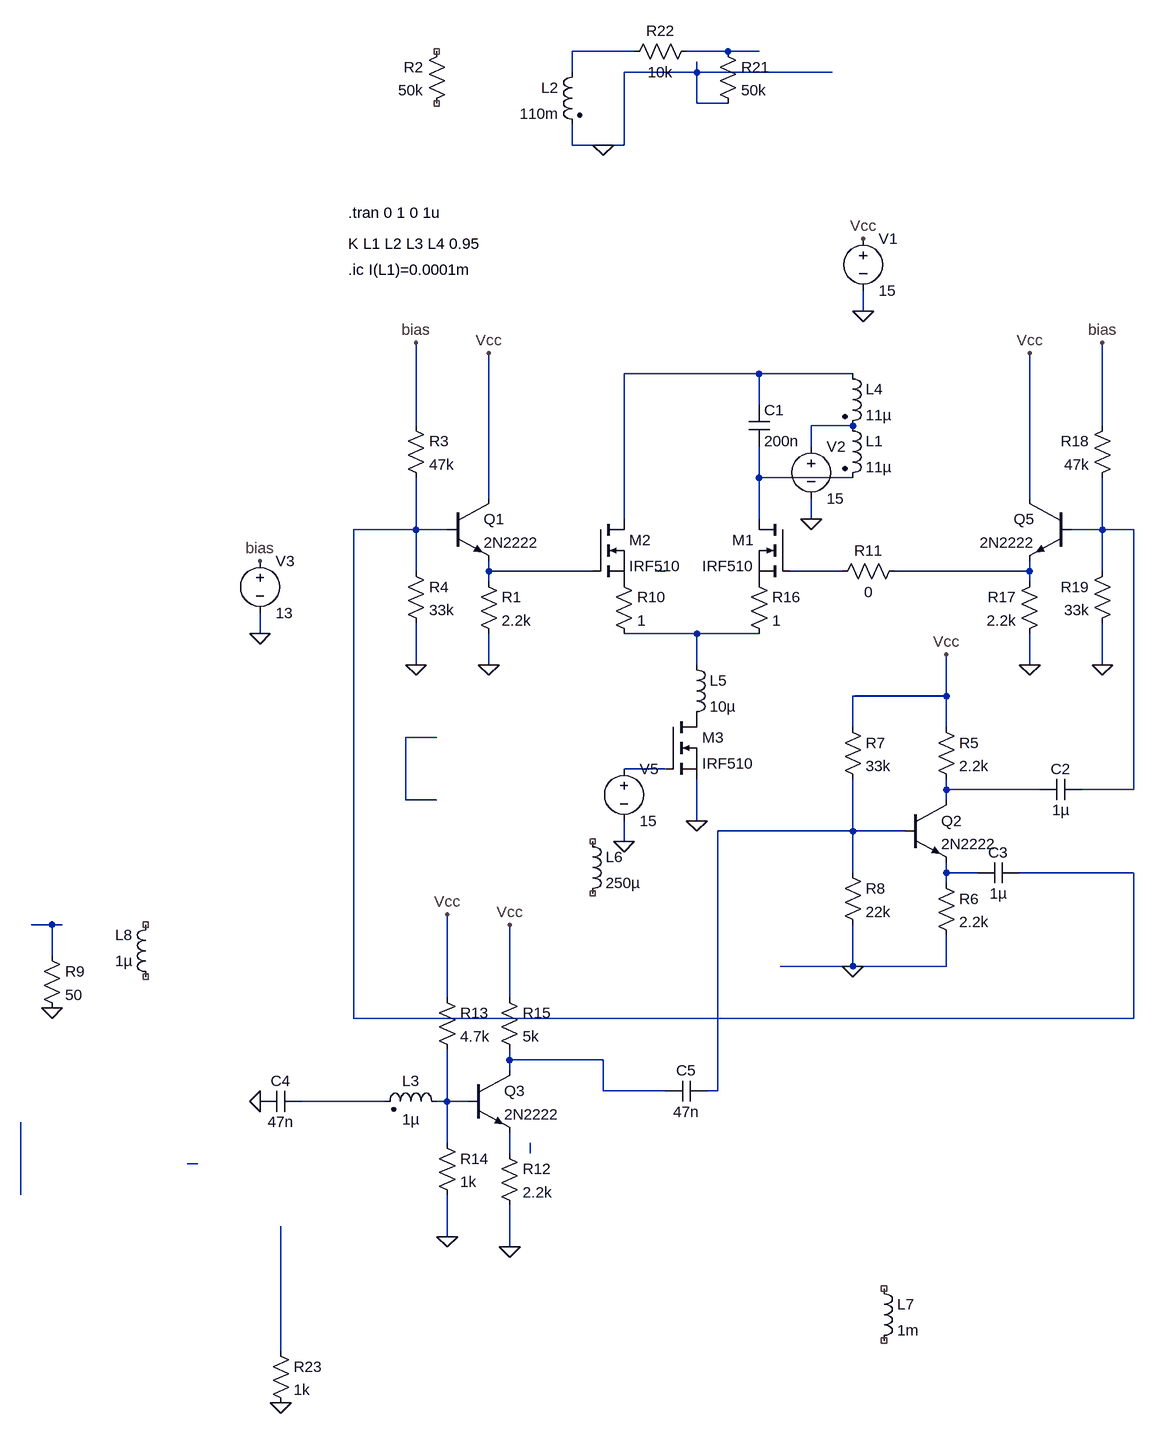
[diagram p0: schematic royer10_mosfet.asc]
royer10_mosfet.asc, the LTspice schematic file:
Version 4
SHEET 1 2216 1876
WIRE 48 -240 -48 -240
WIRE 192 -240 128 -240
WIRE 240 -240 192 -240
WIRE -48 -208 -48 -240
WIRE 144 -208 144 -224
WIRE 144 -208 32 -208
WIRE 352 -208 144 -208
WIRE 144 -160 144 -208
WIRE 192 -160 144 -160
WIRE -48 -96 -48 -128
WIRE 0 -96 -48 -96
WIRE 32 -96 32 -208
WIRE 32 -96 0 -96
WIRE 400 160 400 128
WIRE 240 256 32 256
WIRE 384 256 240 256
WIRE 240 304 240 256
WIRE -288 336 -288 208
WIRE 384 336 320 336
WIRE 768 336 768 208
WIRE 320 368 320 336
WIRE 240 416 240 368
WIRE 384 416 240 416
WIRE -176 448 -176 224
WIRE 656 448 656 224
WIRE 32 480 32 256
WIRE 240 480 240 416
WIRE 320 480 320 448
WIRE -288 496 -288 416
WIRE -288 496 -384 496
WIRE -240 496 -288 496
WIRE 768 496 768 416
WIRE 768 496 720 496
WIRE 816 496 768 496
WIRE -288 560 -288 496
WIRE -176 560 -176 544
WIRE -16 560 -176 560
WIRE 96 560 80 560
WIRE 368 560 288 560
WIRE 656 560 656 544
WIRE 656 560 448 560
WIRE 768 560 768 496
WIRE -176 576 -176 560
WIRE 656 576 656 560
WIRE -528 656 -528 624
WIRE 144 656 32 656
WIRE 240 656 144 656
WIRE -288 704 -288 640
WIRE -176 704 -176 656
WIRE 144 704 144 656
WIRE 656 704 656 656
WIRE 768 704 768 640
WIRE 528 752 528 688
WIRE 528 752 384 752
WIRE 384 800 384 752
WIRE 528 800 528 752
WIRE -256 816 -304 816
WIRE 96 864 32 864
WIRE 528 896 528 880
WIRE 672 896 528 896
WIRE 816 896 816 496
WIRE 816 896 736 896
WIRE -304 912 -304 816
WIRE -256 912 -304 912
WIRE 528 912 528 896
WIRE 144 944 144 880
WIRE 384 960 384 880
WIRE 384 960 176 960
WIRE 464 960 384 960
WIRE 32 976 32 944
WIRE 384 1024 384 960
WIRE 528 1024 528 1008
WIRE 576 1024 528 1024
WIRE 816 1024 640 1024
WIRE 528 1040 528 1024
WIRE -848 1104 -880 1104
WIRE -832 1104 -848 1104
WIRE -848 1152 -848 1104
WIRE 384 1168 384 1104
WIRE 384 1168 272 1168
WIRE 528 1168 528 1120
WIRE 528 1168 384 1168
WIRE -240 1216 -240 1088
WIRE -144 1216 -144 1104
WIRE -384 1248 -384 496
WIRE 816 1248 816 1024
WIRE 816 1248 -384 1248
WIRE -144 1312 -144 1296
WIRE 0 1312 -144 1312
WIRE -144 1328 -144 1312
WIRE 0 1360 0 1312
WIRE 96 1360 0 1360
WIRE 176 1360 176 960
WIRE 176 1360 160 1360
WIRE -336 1376 -464 1376
WIRE -240 1376 -240 1296
WIRE -240 1376 -256 1376
WIRE -208 1376 -240 1376
WIRE -240 1440 -240 1376
WIRE -144 1456 -144 1424
WIRE -112 1456 -112 1440
WIRE -624 1472 -640 1472
WIRE -896 1520 -896 1408
WIRE -240 1584 -240 1520
WIRE -144 1600 -144 1536
WIRE -496 1760 -496 1568
FLAG 400 160 0
FLAG 400 48 Vcc
FLAG 384 1168 0
FLAG 528 688 Vcc
FLAG 656 224 Vcc
FLAG 656 704 0
FLAG 768 704 0
FLAG -176 224 Vcc
FLAG -176 704 0
FLAG -288 704 0
FLAG 144 944 0
FLAG 320 480 0
FLAG -144 1104 Vcc
FLAG -144 1600 0
FLAG -240 1584 0
FLAG -240 1088 Vcc
FLAG -496 1840 0
FLAG -528 656 0
FLAG -528 544 bias
FLAG -288 208 bias
FLAG 768 208 bias
FLAG 0 -96 0
FLAG 32 976 0
FLAG -848 1232 0
FLAG -528 1376 0
SYMBOL voltage 400 32 R0
WINDOW 123 0 0 Left 0
WINDOW 39 0 0 Left 0
SYMATTR InstName V1
SYMATTR Value 15
SYMBOL ind2 368 320 R0
SYMATTR InstName L1
SYMATTR Value 11µ
SYMATTR Type ind
SYMBOL ind2 -32 -224 M0
SYMATTR InstName L2
SYMATTR Value 110m
SYMATTR Type ind
SYMATTR SpiceLine Rser=5
SYMBOL ind2 -240 1392 M270
WINDOW 0 32 56 VTop 2
WINDOW 3 4 56 VBottom 2
SYMATTR InstName L3
SYMATTR Value 1µ
SYMATTR Type ind
SYMATTR SpiceLine Rser=0.1
SYMBOL ind2 368 240 R0
SYMATTR InstName L4
SYMATTR Value 11µ
SYMATTR Type ind
SYMBOL cap 224 304 R0
SYMATTR InstName C1
SYMATTR Value 200n
SYMBOL res -240 -256 M0
SYMATTR InstName R2
SYMATTR Value 50k
SYMBOL npn 464 912 R0
SYMATTR InstName Q2
SYMATTR Value 2N2222
SYMBOL res 512 784 R0
SYMATTR InstName R5
SYMATTR Value 2.2k
SYMBOL res 512 1024 R0
SYMATTR InstName R6
SYMATTR Value 2.2k
SYMBOL res 368 784 R0
SYMATTR InstName R7
SYMATTR Value 33k
SYMBOL res 368 1008 R0
SYMATTR InstName R8
SYMATTR Value 22k
SYMBOL cap -528 1360 M90
WINDOW 0 0 32 VBottom 2
WINDOW 3 32 32 VTop 2
SYMATTR InstName C4
SYMATTR Value 47n
SYMBOL cap 736 880 R90
WINDOW 0 0 32 VBottom 2
WINDOW 3 32 32 VTop 2
SYMATTR InstName C2
SYMATTR Value 1µ
SYMBOL cap 640 1008 R90
WINDOW 0 0 32 VBottom 2
WINDOW 3 32 32 VTop 2
SYMATTR InstName C3
SYMATTR Value 1µ
SYMBOL npn 720 448 M0
SYMATTR InstName Q5
SYMATTR Value 2N2222
SYMBOL res 672 560 M0
SYMATTR InstName R17
SYMATTR Value 2.2k
SYMBOL res 784 320 M0
SYMATTR InstName R18
SYMATTR Value 47k
SYMBOL res 784 544 M0
SYMATTR InstName R19
SYMATTR Value 33k
SYMBOL nmos 288 480 M0
SYMATTR InstName M1
SYMATTR Value IRF510
SYMBOL nmos -16 480 R0
SYMATTR InstName M2
SYMATTR Value IRF510
SYMBOL npn -240 448 R0
SYMATTR InstName Q1
SYMATTR Value 2N2222
SYMBOL res -192 560 R0
SYMATTR InstName R1
SYMATTR Value 2.2k
SYMBOL res -304 320 R0
SYMATTR InstName R3
SYMATTR Value 47k
SYMBOL res -304 544 R0
SYMATTR InstName R4
SYMATTR Value 33k
SYMBOL ind 128 688 R0
SYMATTR InstName L5
SYMATTR Value 10µ
SYMBOL ind -32 960 R0
SYMATTR InstName L6
SYMATTR Value 250µ
SYMBOL res 464 544 R90
WINDOW 0 0 56 VBottom 2
WINDOW 3 32 56 VTop 2
SYMATTR InstName R11
SYMATTR Value 0
SYMBOL voltage 320 352 R0
WINDOW 123 0 0 Left 0
WINDOW 39 0 0 Left 0
SYMATTR InstName V2
SYMATTR Value 15
SYMBOL npn -208 1328 R0
SYMATTR InstName Q3
SYMATTR Value 2N2222
SYMBOL res -160 1440 R0
SYMATTR InstName R12
SYMATTR Value 2.2k
SYMBOL res -256 1200 R0
SYMATTR InstName R13
SYMATTR Value 4.7k
SYMBOL res -256 1424 R0
SYMATTR InstName R14
SYMATTR Value 1k
SYMBOL cap 96 1344 M90
WINDOW 0 0 32 VBottom 2
WINDOW 3 32 32 VTop 2
SYMATTR InstName C5
SYMATTR Value 47n
SYMBOL res -160 1200 R0
SYMATTR InstName R15
SYMATTR Value 5k
SYMBOL voltage -528 528 R0
WINDOW 123 0 0 Left 0
WINDOW 39 0 0 Left 0
SYMATTR InstName V3
SYMATTR Value 13
SYMBOL res 176 -256 R0
SYMATTR InstName R21
SYMATTR Value 50k
SYMBOL res 144 -256 R90
WINDOW 0 0 56 VBottom 2
WINDOW 3 32 56 VTop 2
SYMATTR InstName R22
SYMATTR Value 10k
SYMBOL res -512 1744 R0
SYMATTR InstName R23
SYMATTR Value 1k
SYMBOL nmos 96 784 R0
SYMATTR InstName M3
SYMATTR Value IRF510
SYMBOL voltage 32 848 R0
WINDOW 123 0 0 Left 0
WINDOW 39 0 0 Left 0
SYMATTR InstName V5
SYMATTR Value 15
SYMBOL res -864 1136 R0
SYMATTR InstName R9
SYMATTR Value 50
SYMBOL ind 416 1648 R0
SYMATTR InstName L7
SYMATTR Value 1m
SYMBOL res 16 560 R0
SYMATTR InstName R10
SYMATTR Value 1
SYMBOL res 224 560 R0
SYMATTR InstName R16
SYMATTR Value 1
SYMBOL ind -688 1200 R180
WINDOW 0 36 80 Left 2
WINDOW 3 36 40 Left 2
SYMATTR InstName L8
SYMATTR Value 1µ
TEXT -392 56 Left 2 !K L1 L2 L3 L4 0.95
TEXT -392 8 Left 2 !.tran 0 1 0 1u
TEXT -392 96 Left 2 !.ic I(L1)=0.0001m

The netlist it stands for:
* royer10_mosfet.asc
V1 Vcc 0 15
L1 N004 N005 11µ
L2 N001 0 110m Rser=5
L3 N021 N020 1µ Rser=0.1
L4 N003 N004 11µ
C1 N003 N005 200n
R2 NC_01 NC_02 50k
Q2 N015 N016 N017 0 2N2222
R5 Vcc N015 2.2k
R6 N017 0 2.2k
R7 Vcc N016 33k
R8 N016 0 22k
C4 0 N020 47n
C2 N007 N015 1µ
C3 N006 N017 1µ
Q5 Vcc N007 N011 0 2N2222
R17 N011 0 2.2k
R18 bias N007 47k
R19 N007 0 33k
M1 N005 N010 P001 P001 IRF510
M2 N003 N008 P002 P002 IRF510
Q1 Vcc N006 N008 0 2N2222
R1 N008 0 2.2k
R3 bias N006 47k
R4 N006 0 33k
L5 N012 P003 10µ
L6 NC_03 NC_04 250µ
R11 N011 N010 0
V2 N004 0 15
Q3 N019 N021 N022 0 2N2222
R12 N022 0 2.2k
R13 Vcc N021 4.7k
R14 N021 0 1k
C5 N019 N016 47n
R15 Vcc N019 5k
V3 bias 0 13
R21 N002 0 50k
R22 N002 N001 10k
R23 N026 0 1k
M3 P003 N014 0 0 IRF510
V5 N014 0 15
R9 N018 0 50
L7 NC_05 NC_06 1m
R10 P002 N012 1
R16 P001 N012 1
L8 NC_07 NC_08 1µ
.model NPN NPN
.model PNP PNP
.lib standard.bjt
.model NMOS NMOS
.model PMOS PMOS
.lib standard.mos
K L1 L2 L3 L4 0.95
.tran 0 1 0 1u
.ic I(L1)=0.0001m
.backanno
.end